# EAGLE design MAX86141_HEG_MINI_HEADPIECE (EAGLE 9.6.2)
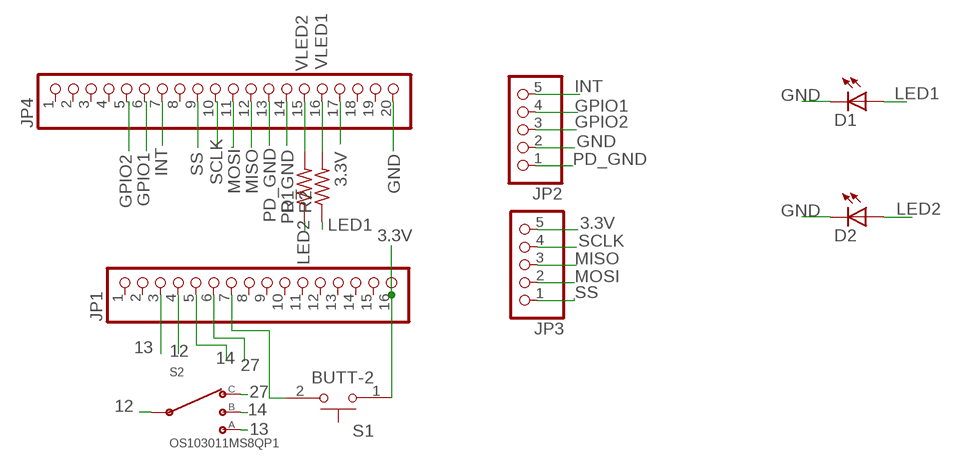
[diagram p0: schematic, sheet 1]

## Parts
D1  LED1206  [LED-1206]
D2  LED1206  [LED-1206]
JP1  PINHD-1X16  [1X16]
JP2  PINHD-1X5  [1X05]
JP3  PINHD-1X5  [1X05]
JP4  PINHD-1X20  [1X20]
R1  R-US_0204/5  [0204/5]
R2  R-US_0204/5  [0204/5]
S1  BUTT-2  [SW_BUTT-2]
S2  OS103011MS8QP1  [OS102011MS8QP1]

## Nets
3.3V: JP1.16 JP3.5 JP4.17 S1.1
12: JP1.4 S2.2(C)
13: JP1.3 S2.1
14: JP1.5 S2.3
27: JP1.6 S2.4
GND: D1.C D2.C JP2.2 JP4.20
GPIO1: JP2.4 JP4.6
GPIO2: JP2.3 JP4.5
INT: JP2.5 JP4.7
LED1: D1.A R2.1
LED2: D2.A R1.1
MISO: JP3.3 JP4.12
MOSI: JP3.2 JP4.11
N$5: JP1.7 S1.2
PD_GND: JP2.1 JP4.13 JP4.14
SCLK: JP3.4 JP4.10
SS: JP3.1 JP4.9
VLED1: JP4.16 R2.2
VLED2: JP4.15 R1.2
Unconnected: JP1.1 JP1.2 JP1.8 JP1.9 JP1.10 JP1.11 JP1.12 JP1.13 JP1.14 JP1.15 JP4.1 JP4.2 JP4.3 JP4.4 JP4.8 JP4.18 JP4.19

## Library data of the parts
D1 D2 = epic:LED: LEDs Standard schematic elements and footprints for 5mm, 3mm, 1206, and 0603 sized LEDs. 5mm - Spark Fun Electronics SKU : COM-00529 (and others)
JP1 = pinhead:PINHD-1X16: PIN HEADER
JP2 JP3 = pinhead:PINHD-1X5: PIN HEADER
JP4 = pinhead:PINHD-1X20: PIN HEADER
R1 R2 = adafruit:R-US_: RESISTOR, American symbol
S1 = BUTT-2:BUTT-2: Tactile Switches MINI PUSH BUTTON SWITCH 2-PIN QTY. 4 Check prices <https://pricing.snapeda.com/parts/BUTT-2/Gravitech/view-part?ref=eda>; AVAILABILITY: In Stock; DESCRIPTION: Tactile Switches MINI PUSH BUTTON SWITCH 2-PIN QTY. 4; MF: Gravitech; MP: BUTT-2; PACKAGE: None; PRICE: None
S2 = OS103011MS8QP1:OS103011MS8QP1: Slide Switch SP3T Through Hole Check prices <https://pricing.snapeda.com/parts/OS103011MS8QP1/C%26K/view-part?ref=eda>; AVAILABILITY: In Stock; DESCRIPTION: SLIDE SWITCH SPDT T/H ON-ON-ON B; MF: C&K; MP: OS103011MS8QP1; PACKAGE: None; PRICE: None

## Board
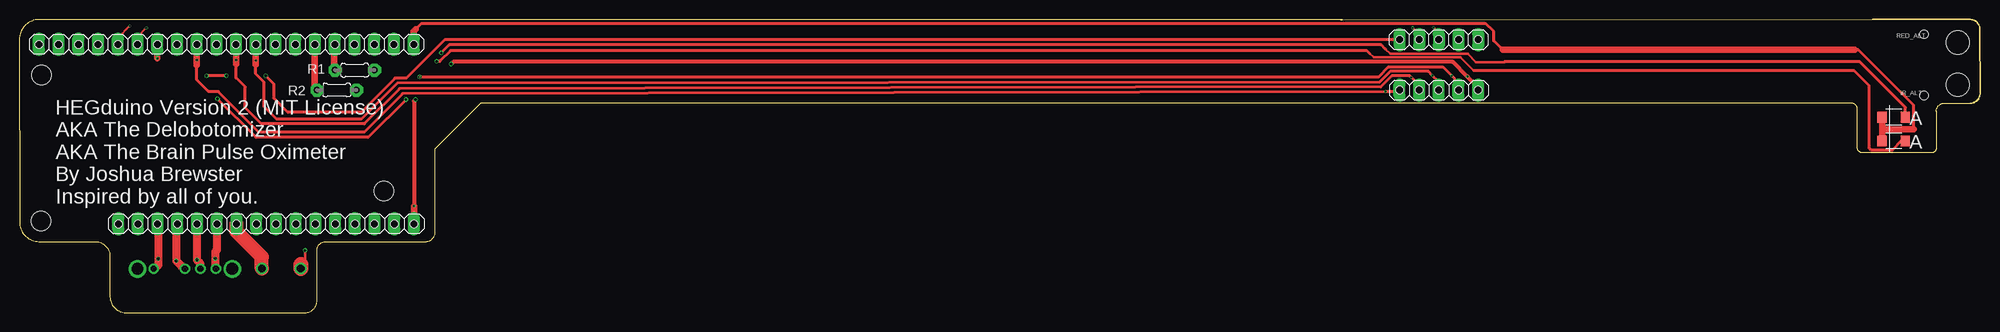
[diagram p1: board, top side]
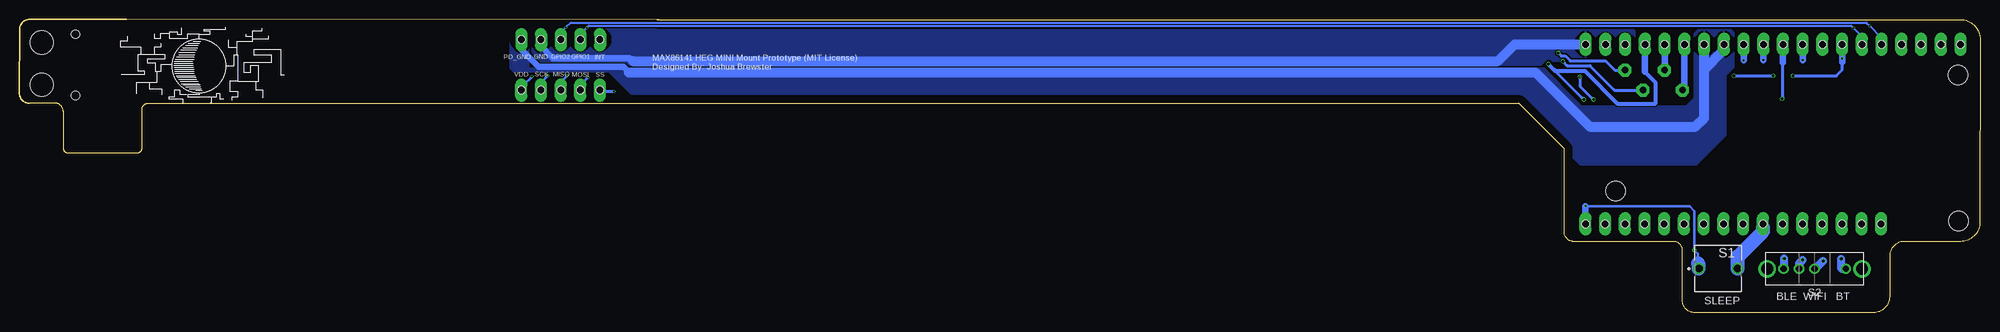
[diagram p2: board, bottom side, seen from below]

Size 252.5 x 37.74 mm. Coordinates in mm from the lower left corner, seen from the top.
Outline: 167.69,26.92 235.43,26.95 235.94,26.95 arc-90 236.7,26.16 236.7,21.21 arc90 237.39,20.55 246.23,20.55 arc90 246.86,21.21 246.86,25.93 arc-90 247.93,26.98 251.21,26.95 arc90 252.5,28.22 252.48,36.47 arc90 251.21,37.74 238.66,37.74 170.13,37.72 170.38,37.72 2.49,37.72 arc90 0,35.18 0.03,11.68 arc90 2.51,9.14 9.88,9.14 arc-90 11.66,7.11 11.66,2.03 arc90 13.69,0 36.8,0 arc90 38.33,1.52 38.33,8.13 arc-90 39.6,9.14 52.3,9.14 arc90 53.57,10.41 53.57,21.08 59.41,26.92 177.77,26.92
Copper layers (1*16): Top 0.035mm / dielectric 1.5mm / Bottom 0.035mm
Design rules "default *": minimum track width 6mil, minimum drill 0.35mm, track to track 6mil, track to pad 6mil, pad to pad 6mil, via to via 2mil, smd to smd 6mil, copper to edge 40mil, drill to drill 6mil, minimum pad ring 10mil, minimum via ring 3mil, stop-mask expansion 4mil, vias tented up to drill 0mil, thermal gap 10mil
Holes 1.1 mm at 245.29,27.97 245.29,35.84
Holes 0.99 mm at 2.51,34.54 5.05,34.54 7.59,34.54 10.13,34.54 20.29,34.54 17.75,34.54 15.21,34.54 12.67,34.54 30.45,34.54 27.91,34.54 25.37,34.54 22.83,34.54 40.61,34.54 38.07,34.54 35.53,34.54 32.99,34.54 50.77,34.54 48.23,34.54 45.69,34.54 43.15,34.54 43.21,11.43 45.75,11.43 48.29,11.43 50.83,11.43 33.05,11.43 35.59,11.43 38.13,11.43 40.67,11.43 22.89,11.43 25.43,11.43 27.97,11.43 30.51,11.43 12.73,11.43 15.27,11.43 17.81,11.43 20.35,11.43 177.72,35.13 180.26,35.13 182.8,35.13 185.34,35.13 187.88,35.13 187.88,28.63 185.34,28.63 182.8,28.63 180.26,28.63 177.72,28.63
Holes 2.54 mm at 2.79,11.81 2.87,30.61 46.96,15.67
Holes 3 mm at 249.61,29.34 249.61,34.77

### Footprints (pad centres in the part's own frame; a part is rotated, then mirrored left to right if it is on the bottom)
LED-1206 = smd 1.2 x 1.4: A -1.5,0; C 1.5,0
1X16 = drill 1.016 long: 1 -19.05,0; 2 -16.51,0; 3 -13.97,0; 4 -11.43,0; 5 -8.89,0; 6 -6.35,0; 7 -3.81,0; 8 -1.27,0; 9 1.27,0; 10 3.81,0; 11 6.35,0; 12 8.89,0; 13 11.43,0; 14 13.97,0; 15 16.51,0; 16 19.05,0
1X05 = drill 1.016 long: 1 -5.08,0; 2 -2.54,0; 3 0,0; 4 2.54,0; 5 5.08,0
1X20 = drill 1.016 long: 1 -24.13,0; 2 -21.59,0; 3 -19.05,0; 4 -16.51,0; 5 -13.97,0; 6 -11.43,0; 7 -8.89,0; 8 -6.35,0; 9 -3.81,0; 10 -1.27,0; 11 1.27,0; 12 3.81,0; 13 6.35,0; 14 8.89,0; 15 11.43,0; 16 13.97,0; 17 16.51,0; 18 19.05,0; 19 21.59,0; 20 24.13,0
0204/5 = drill 0.813 pad 1.676 octagon: 1 -2.54,0; 2 2.54,0
SW_BUTT-2 = drill 1: 1 -2.5,0; 2 2.5,0
OS102011MS8QP1 = drill 0.8: 1 -4,0; 2 0,0; 3 2,0; 4 4,0 | drill 1.5: MOUNT1 -6.1,0; MOUNT2 6.1,0

### Placement (x,y rotation side)
D1  241.38,25.15 180 top
D2  241.38,22.1 180 top
JP1  31.78,11.43 0 top
JP2  182.8,35.13 180 top
JP3  182.8,28.63 0 top
JP4  26.64,34.54 0 top
R1  40.87,28.65 180 top
R2  43.18,31.22 180 top
S1  33.73,5.66 0 bottom
S2  21.31,5.64 180 bottom

### Tracks (layer width: path | path; a pad name or v marks a point on that pad's centre or on a via)
3.3V  (via drill 0.2, 0.35)
  Top 0.305: 36.23,6.2 36.8,6.77 36.8,7.98 v36.78,8
  Top 0.508: JP3.5 187.88,28.98 v186.49,30.38 184.58,32.28 55.88,32.28 v55.6,32 | v51.03,27.43 50.83,27.23 v50.83,13.72
  Top 0.813: JP1.16 v50.83,13.72
  Top 1.905: 36.23,6.2 S1.1
  Bottom 0.305: 36.35,6.29 36.35,7.57 v36.78,8 36.78,13.06 37.39,13.66 50.77,13.66 v50.83,13.72
  Bottom 0.406: 54.84,31.22 51.05,27.43 v51.03,27.43 | v186.49,30.38 187.68,29.19
  Bottom 0.508: v55.6,32 54.81,31.22 | 54.81,31.22 54.71,31.12 50.9,31.12 46.69,26.9 41.83,26.9 41.83,29.67 43.15,30.99 | 54.84,31.22 54.81,31.22
  Bottom 0.813: 43.15,30.99 JP4.17 | v50.83,13.72 50.83,12.12
  Bottom 1.778: S1.1 36.23,6.17 36.35,6.29
12  (via drill 0.35)
  Top 1.016: JP1.4 20.19,11.28 v20.19,6.66 20.88,5.97 20.88,5.94
  Bottom 1.016: v20.19,6.66 21.13,5.72 21.13,5.64 S2.2
13  (via drill 0.35)
  Top 1.016: JP1.3 17.88,11.35 v17.88,6.92 17.88,6.1 17.73,5.94
  Bottom 1.016: S2.1 17.77,5.64 17.88,5.75 17.88,5.74 v17.88,6.92
14  (via drill 0.35)
  Top 1.016: JP1.5 22.86,11.41 v22.86,6.8 23.27,6.39 23.27,6.17
  Bottom 1.016: v22.86,6.8 22.85,6.79 23.31,6.33 S2.3
27  (via drill 0.35)
  Top 1.016: JP1.6 25.43,8.05 25.22,7.85 v25.22,6.95 25.22,6.22
  Bottom 1.016: v25.22,6.95 25.25,6.92 25.25,5.7 S2.4
GND
  Top 0.406: 243.94,23.62 243.94,26.7 236.83,33.81 236.35,33.81 | 191.03,33.81 189.86,34.98 189.86,36.2 188.85,37.21 51.77,37.21 51,36.45
  Top 0.813: 243.94,23.62 239.88,23.62 D1.C D2.C | 236.35,33.81 191.03,33.81 | 51,36.45 50.77,36.22 JP4.20
  Bottom 0.813: JP2.2 185.34,34.27 183.85,32.77 173.94,32.77 173.53,32.36
  Bottom 1.27: 173.53,32.36 62.13,32.36 59.94,34.54 JP4.20
  pour Bottom: 186.51,36.5 186.51,31.83 56.57,31.83 55.73,32.66 55.4,32.66 55.09,32.36 44.55,32.36 44.37,32.54 44.37,36.2 44.68,36.5
GPIO1  (via drill 0.2)
  Top 0.254: v179.44,36.66 180.14,35.97 180.14,35.87 | v16.33,36.65 15.21,35.53 15.21,35.15 15.21,34.57 JP4.6
  Bottom 0.254: JP2.4 180.26,35.84 v179.44,36.66 179.17,36.93 16.61,36.93 v16.33,36.65 15.19,35.51
GPIO2  (via drill 0.2)
  Top 0.254: v182.13,36.72 182.78,36.07 182.78,35.81 | v14.22,36.91 12.73,35.41 12.73,35.03 12.67,34.98 JP4.5
  Bottom 0.254: JP2.3 182.8,36.04 v182.13,36.72 181.51,37.34 14.66,37.34 v14.22,36.91 12.73,35.41
INT  (via drill 0.2, 0.35)
  Top 0.406: JP2.5 54.79,35.13 49.83,30.17 48.39,30.17 43.99,25.78 34.57,25.78 32.72,27.63 32.72,29.49 v31.72,30.48 | v26.64,30.48 v24.1,30.48
  Top 0.813: v17.75,32.74 17.75,33.86
  Bottom 0.406: v31.72,30.48 v26.64,30.48 | v24.1,30.48 18.52,30.48 17.75,31.24 17.75,32.23
  Bottom 0.813: JP4.7 v17.75,32.74 17.75,32.23
LED1  (via drill 0.35)
  Top 0.305: 191.24,32.26 187.55,32.26 186.51,33.3 176.56,33.3 175.95,33.91
  Top 0.406: 191.24,32.26 191.26,32.28 237.01,32.28 242.88,26.42 D1.A | 175.95,33.91 175.39,34.47 55.37,34.47 v54.33,33.43
  Bottom 0.406: v54.33,33.43 53.95,33.05 53.42,33.05 52.78,32.41 48.23,32.41 47.04,31.22 R2.1
LED2  (via drill 0.35)
  Top 0.305: 187.25,31.19 185.6,32.84 174.42,32.84 173.89,33.38
  Top 0.406: 173.89,33.38 173.53,33.73 55.52,33.73 54.13,32.33 v53.72,32.33 | D2.A 242.34,22.1 241.23,20.99 238.44,20.99 238.18,21.26 238.18,29.26 236.25,31.19 187.25,31.19
  Bottom 0.406: v53.72,32.33 53.19,31.8 50.24,31.8 47.09,28.65 R1.1
MISO  (via drill 0.2)
  Top 0.406: JP3.3 182.8,29.69 v181.98,30.52 181.43,31.06 176.55,31.06 175.16,29.67 48.62,29.52 44.02,24.92 33.12,24.92 31.52,26.52 31.52,29.67 30.45,30.73 30.45,31.88
  Top 0.813: 30.45,31.88 v30.45,32.46 JP4.12
  Bottom 0.406: v181.98,30.52 182.75,29.74 182.75,29.44
  Bottom 0.813: v30.45,32.46 30.45,33.45
MOSI  (via drill 0.2)
  Top 0.406: JP3.2 180.26,29.26 v179.25,30.28 179.02,30.51 176.78,30.51 175.34,29.06 48.95,28.83 44.4,24.28 31.14,24.28 29.08,26.34 29.08,29.06 27.91,30.23 27.91,31.98
  Top 0.813: 27.91,31.98 v27.91,32.51 JP4.11
  Bottom 0.406: v179.25,30.28 180.11,29.41
  Bottom 0.813: v27.91,32.51 27.91,33.78 27.89,33.81
N$5
  Top 1.778: S1.2 31.23,7.16 27.97,10.43 JP1.7
  Bottom 1.778: S1.2 31.23,7.19 27.94,10.48 27.94,10.87
PD_GND
  Bottom 0.813: JP2.1 187.88,33.91 185.62,31.65 174.7,31.65 173.99,30.94
  Bottom 1.27: 173.99,30.94 57.28,30.94 50.27,23.93 36.65,23.93 35.53,25.04 35.53,31.29 | 35.53,31.29 JP4.14 | 35.53,31.29 32.99,33.83 JP4.13
  pour Bottom: 186.94,36.83 186.94,31.5 56.21,31.5 51.92,27.2 51.92,27.18 51.36,26.62 37.85,26.62 36.83,27.64 36.83,35.94 35.94,36.83 32.49,36.83 31.72,36.07 31.72,31.5 32.74,30.48 32.74,22.78 36.55,18.97 51.46,18.97 59.41,26.92 172.57,26.92 176.58,30.94 188.85,30.94 189.33,31.42 189.33,36.04 188.54,36.83
SCLK  (via drill 0.2, 0.35)  (1 unrouted)
  Top 0.406: JP3.4 185.34,29.59 v184.45,30.48 183.31,31.62 176.32,31.62 175.03,30.33 v51.54,30.33 | v49.78,27.43 44.91,22.55 30.48,22.55 v25.5,27.53
  Bottom 0.406: v49.78,27.43 49.8,27.43 51.54,29.17 v51.54,30.34 | 25.37,32.16 25.37,27.66 v25.5,27.53 | v184.45,30.48 185.34,29.59 185.34,29.41
  Bottom 0.813: 25.37,32.16 JP4.10
SS  (via drill 0.2)
  Top 0.406: JP3.1 177.55,28.45 v175.92,28.45 49.35,28.2 44.4,23.24 30.84,23.24 25.63,28.45 24.36,28.45 22.83,29.97 22.83,31.83
  Top 0.813: 22.83,31.83 v22.83,32.51 JP4.9
  Bottom 0.406: v175.92,28.45 176.99,28.45 177.14,28.6
  Bottom 0.813: v22.83,32.51 22.81,32.54 22.81,33.45
VLED1
  Top 0.813: R2.2 40.56,31.29 40.56,34.49 JP4.16
  Bottom 0.813: 40.59,34.57 40.59,31.27 R2.2
VLED2
  Top 0.813: R1.2 38.05,28.93 38.05,34.52 JP4.15
  Bottom 0.813: 38.07,34.49 38.07,28.91 R1.2

### Text on the board
tPlace: RED_ALT | IR_ALT
bPlace: BLE WIFI BT | SLEEP
tNames: HEGduino Version 2 (MIT License) / AKA The Delobotomizer / AKA The Brain Pulse Oximeter / By Joshua Brewster / Inspired by all of you.
bNames: INT | GPIO1 | GPIO2 | GND | PD_GND | MAX86141 HEG MINI Mount Prototype (MIT License) / Designed By: Joshua Brewster | SS | MOSI | MISO | SCK | VDD
Document: 15 / 2 / GND / 0 / 4 / 16 / 17 / 3.3V | 5 / 18 / 23 / 19 / GND / GND / 21 / 22 / 3.3V | RX / TX / GND | Flexible MAX86141 HEG Mini Prototype / Joshua Brewster - MIT License | GND / 5V / 13 / 12 / 14 | 27 / 26 / 25 / 35 / 34 / 33 / 32 / 39 / 36 / EN | 3.3V